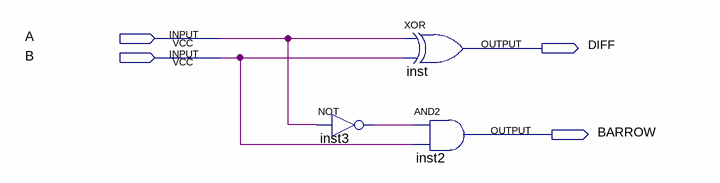
[diagram p0: schematic sheet]
// Quartus schematic Half-Sub.bdf as structural Verilog: 3 symbols, 4 pins
module \Half-Sub  (
  input  A,
  input  B,
  output DIFF,
  output BARROW
);

  wire inst3_out;

  not inst3 (inst3_out, A);
  xor inst (DIFF, A, B);
  and inst2 (BARROW, inst3_out, B);
endmodule
